# EAGLE design esptoy_v122 (EAGLE 7.2.0)
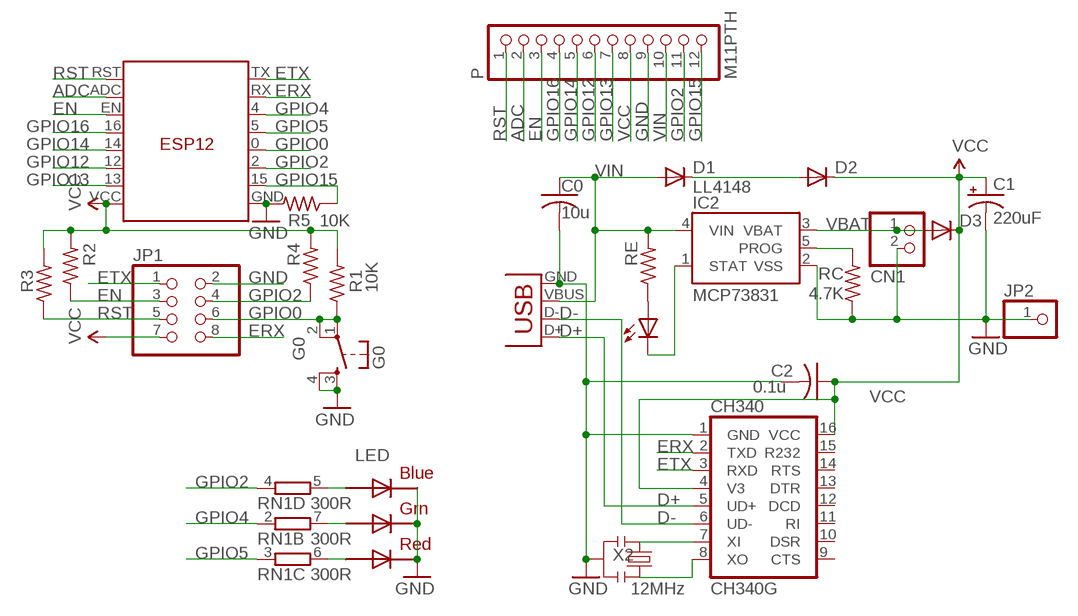
[diagram p0: schematic, sheet 1]

## Parts
C0  10u  C-USC0805K  [C0805K]
C1  220uF  CAP_POL7343  [EIA7343]
C2  0.1u  C-USC0603K  [C0603K]
CH340  CH340G  [SO16]
CHG  0805  LEDCHIPLED_0805  [CHIPLED_0805]
CN1  JST_2PIN-SMT-RA  [JST-PH-2-SMT-RA]
D1  LL4148  DIODESMA  [SMA-DIODE]
D2  DIODESMA  [SMA-DIODE]
D3  DIODESMA  [SMA-DIODE]
G0  G0  TAC_SWITCHSMD  [TACTILE_SWITCH_SMD]
IC2  MCP73831  [SOT23-5]
JP1  PINHD-2X4  [2X04]
JP2  PINHD-1X1CB  [1X01-CLEANBIG]
LED  RGBLED5050  [RGBLED5050]
P  M11PTH  PINHD-1X12-CB  [1X12-CB]
R1  10K  R-US_R0603  [R0603]
R2  R-US_R0603  [R0603]
R3  R-US_R0603  [R0603]
R4  R-US_R0603  [R0603]
R5  10K  R-US_R0603  [R0603]
RC  4.7K  R-US_R0805  [R0805]
RE  R-US_R0603  [R0603]
RN1  300R  4R-NEXB38V  [EXB38V]
U$1  ESP12  [ESP12]
X1  USBSMD  [USB-MINIB]
X2  12MHz  RESONATORSMD  [RESONATOR-SMD]

## Nets
ADC: P.2 U$1.ADC
D+: CH340.5(UD+) X1.D+
D-: CH340.6(UD-) X1.D-
EN: JP1.3 P.3 R2.1 U$1.EN
ERX: CH340.2(TXD) JP1.8 U$1.RX
ETX: CH340.3(RXD) JP1.1 U$1.TX
GND: C0.2 C1.C(-) C2.2 CH340.1(GND) CN1.2 G0.3 G0.4 IC2.2(VSS) JP1.2 JP2.1 LED.4(BLUE_C) LED.5(RED_C) LED.6(GREEN_C) P.9 R5.2 RC.1 U$1.GND X1.GND X2.2
GPIO0: G0.1 G0.2 JP1.6 R1.1 U$1.0(G0)
GPIO2: JP1.4 P.11 R4.1 RN1.4 U$1.2(G2)
GPIO4: RN1.2 U$1.4(G4)
GPIO5: RN1.3 U$1.5(G5)
GPIO12: P.6 U$1.12(G12)
GPIO13: P.7 U$1.13(G13)
GPIO14: P.5 U$1.14(G14)
GPIO15: P.12 R5.1 U$1.15(G15)
GPIO16: P.4 U$1.16(G16)
N$1: D1.C D2.A
N$2: LED.3(BLUE_A) RN1.5
N$3: IC2.5(PROG) RC.2
N$4: CHG.A RE.1
N$5: CHG.C IC2.1(STAT)
N$6: LED.1(GREEN_A) RN1.7
N$7: LED.2(RED_A) RN1.6
N$11: CH340.7(XI) X2.1
N$13: CH340.8(XO) X2.3
RST: JP1.5 P.1 R3.1 U$1.RST
VBAT [power]: CN1.1 D3.A IC2.3(VBAT)
VCC [power]: C1.A(+) C2.1 CH340.4(V3) CH340.16(VCC) D2.C D3.C JP1.7 P.8 R1.2 R2.2 R3.2 R4.2 U$1.VCC
VIN [power]: C0.1 D1.A IC2.4(VIN) P.10 RE.2 X1.VBUS
Unconnected: CH340.9(CTS) CH340.10(DSR) CH340.11(RI) CH340.12(DCD) CH340.13(DTR) CH340.14(RTS) CH340.15(R232) RN1.1 RN1.8

## Library data of the parts
C0 = adafruit2013:C-US: CAPACITOR, American symbol
C1 = SparkFunNew:CAP_POL: Capacitor Polarized These are standard SMD and PTH capacitors. Normally 10uF, 47uF, and 100uF in electrolytic and tantalum varieties. Always verify the external diameter of the through hole cap, it varies with capacity, voltage, and manufacturer. The EIA devices should be standard.
C2 = adafruit:C-US: CAPACITOR, American symbol
CH340 = SparkFunNew:CH340
CHG = led:LED: LED OSRAM: - CHIPLED LG R971, LG N971, LY N971, LG Q971, LY Q971, LO R971, LY R971 LH N974, LH R974 LS Q976, LO Q976, LY Q976 LO Q996 - Hyper CHIPLED LW Q18S LB Q993, LB Q99A, LB R99A - SideLED LS A670, LO A670, LY A670, LG A670, LP A670 LB A673, LV A673, LT A673, LW A673 LH A674 LY A675 LS A676, LA A676, LO A676, LY A676, LW A676 LS A679, LY A679, LG A679 - Hyper Micro SIDELED® LS Y876, LA Y876, LO Y876, LY Y876 LT Y87S - SmartLED LW L88C, LW L88S LB L89C, LB L89S, LG L890 LS L89K, LO L89K, LY L89K LS L896, LA L896, LO L896, LY L896 - TOPLED LS T670, LO T670, LY T670, LG T670, LP T670 LSG T670, LSP T670, LSY T670, LOP T670, LYG T670 LG T671, LOG T671, LSG T671 LB T673, LV T673, LT T673, LW T673 LH T674 LS T676, LA T676, LO T676, LY T676, LB T676, LH T676, LSB T676, LW T676 LB T67C, LV T67C, LT T67C, LS T67K, LO T67K, LY T67K, LW E67C LS E67B, LA E67B, LO E67B, LY E67B, LB E67C, LV E67C, LT E67C LW T67C LS T679, LY T679, LG T679 LS T770, LO T770, LY T770, LG T770, LP T770 LB T773, LV T773, LT T773, LW T773 LH T774 LS E675, LA E675, LY E675, LS T675 LS T776, LA T776, LO T776, LY T776, LB T776 LHGB T686 LT T68C, LB T68C - Hyper Mini TOPLED® LB M676 - Mini TOPLED Santana® LG M470 LS M47K, LO M47K, LY M47K Source: http://www.osram.convergy.de LUXEON: - LUMILED® LXK2-PW12-R00, LXK2-PW12-S00, LXK2-PW14-U00, LXK2-PW14-V00 LXK2-PM12-R00, LXK2-PM12-S00, LXK2-PM14-U00 LXK2-PE12-Q00, LXK2-PE12-R00, LXK2-PE12-S00, LXK2-PE14-T00, LXK2-PE14-U00 LXK2-PB12-K00, LXK2-PB12-L00, LXK2-PB12-M00, LXK2-PB14-N00, LXK2-PB14-P00, LXK2-PB14-Q00 LXK2-PR12-L00, LXK2-PR12-M00, LXK2-PR14-Q00, LXK2-PR14-R00 LXK2-PD12-Q00, LXK2-PD12-R00, LXK2-PD12-S00 LXK2-PH12-R00, LXK2-PH12-S00 LXK2-PL12-P00, LXK2-PL12-Q00, LXK2-PL12-R00 Source: www.luxeon.com KINGBRIGHT: KA-3528ASYC Source: www.kingbright.com
CN1 = adafruit:JST_2PIN: JST 2-Pin Connectors of various flavors SMT-RA (S2B-PH-SM4) 4UConnector #17311 SMT (B2B-PH-SM4) THM-RA (S2B-PH) THM (B2B-PH)
D1-D3 = SparkFunNew:DIODE: Diode These are standard reverse protection diodes and small signal diodes. SMA package can handle up to about 1A. SOD-323 can handle about 200mA. What the SOD-323 package when ordering, there are some mfgs out there that are 5-pin packages.
G0 = SparkFunNew:TAC_SWITCH: Momentary Switch Button commonly used for reset or general input. Spark Fun Electronics SKU : COM-00097
IC2 = SparkFunNew:MCP73831: Microchip's MCP73831 Miniature single cell, fully integrated Li-Ion, Li-polymer charge management controller http://ww1.microchip.com/downloads/en/DeviceDoc/21984a.pdf
JP1 = pinhead:PINHD-2X4: PIN HEADER
JP2 = adafruit:PINHD-1X1: Pin header 1x1 for 0.1" spacing With round pins
LED = adafruit:RGBLED: For 5050 RGB LEDs, the order of the LEDs may vary from one manufacturer to another!
P = adafruit:PINHD-1X12: PIN HEADER
R1-R5 RE = adafruit (picker 的冲突副本 2014-10-29):R-US_: RESISTOR, American symbol
RC = adafruit2013:R-US_: RESISTOR, American symbol
RN1 = resistor-dil:4R-N: Array Chip Resistor Source: RS Component / Phycomp; OC_FARNELL: unknown; OC_NEWARK: unknown
U$1 = JeeParts:ESP12
X1 = SparkFun:USB: USB Connectors USB-B-PTH is fully proven SKU : PRT-00139 USB-miniB is fully proven SKU : PRT-00587 USB-A-PCB is untested. USB-A-H is throughly reviewed, but untested. Spark Fun Electronics SKU : PRT-00437 USB-B-SMT is throughly reviewed, but untested. Needs silkscreen touching up. USB-A-S has not been used/tested USB-MB-H has not been used/tested
X2 = SparkFunNew:RESONATOR: Resonator Small SMD resonator. This is the itty bitty 10/20MHz resonators with built in caps. CSTCE10M0G55 and CSTCE20M0V53. Footprint has been reviewed closely but hasn't been tested yet.

## Net classes
0 default: width 0.178 mm, clearance 0.178 mm
1 power: width 0.254 mm, clearance 0.203 mm

## Board
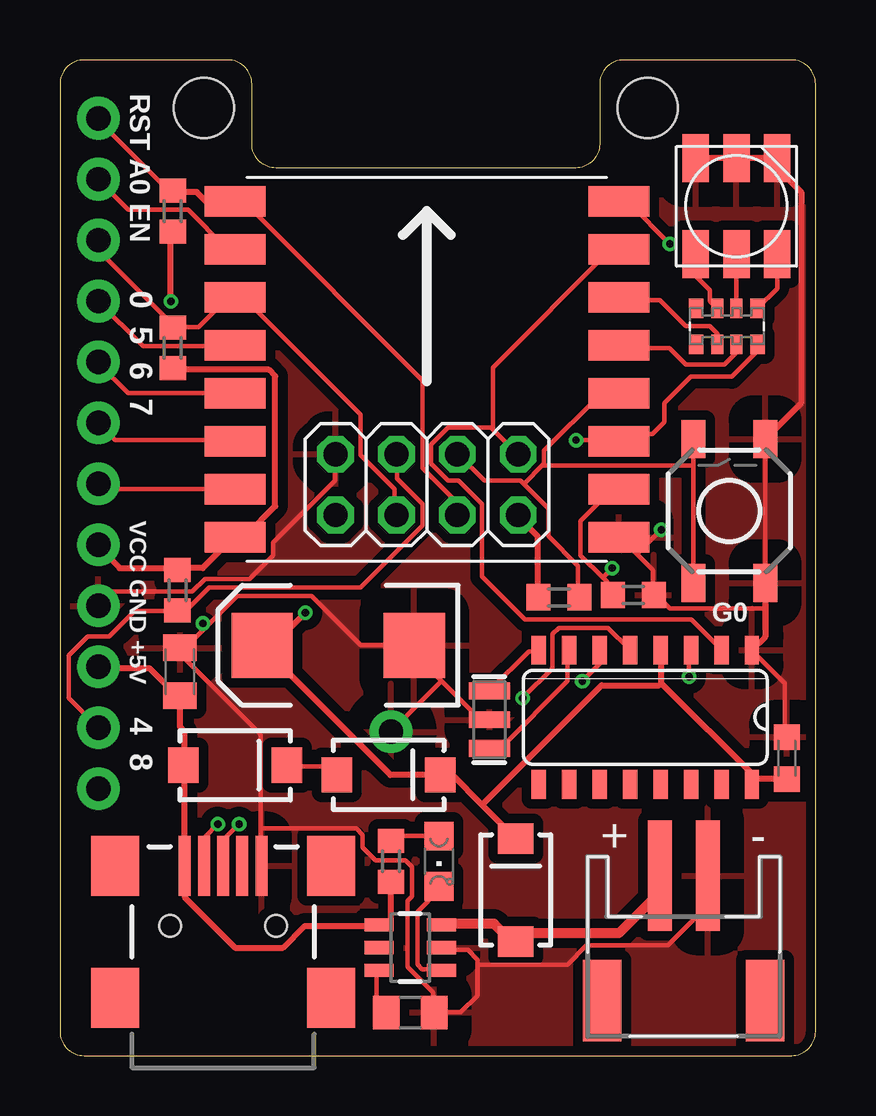
[diagram p1: board, top side]
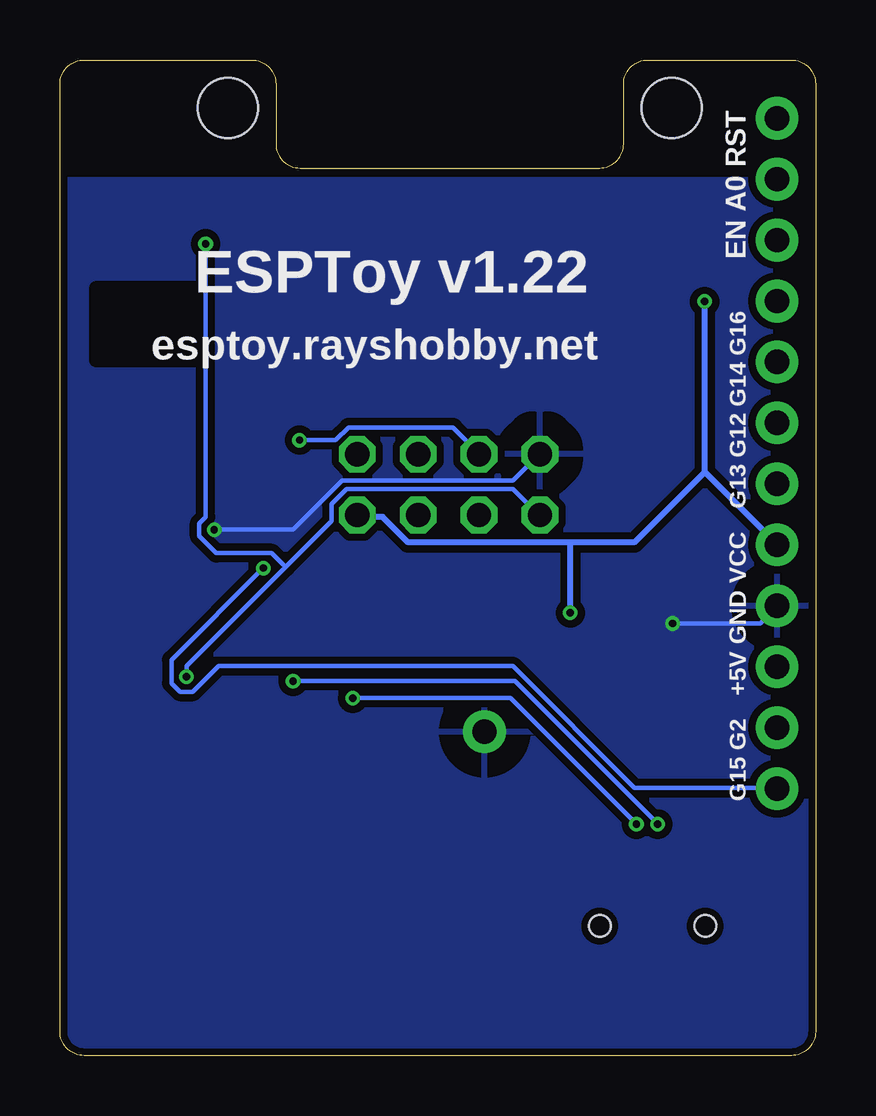
[diagram p2: board, bottom side, seen from below]

Size 31.5 x 41.5 mm. Coordinates in mm from the lower left corner, seen from the top.
Outline: 1,0 30.5,0 arc90 31.5,1 31.5,40.5 arc90 30.5,41.5 23.5,41.5 arc90 22.5,40.5 22.5,38 arc-90 21.5,37 9,37 arc-90 8,38 8,40.5 arc90 7,41.5 1,41.5 arc90 0,40.5 0,1 arc90 1,0
Copper layers (1*16): Top 0.035mm / dielectric 1.5mm / Bottom 0.035mm
Design rules "Fusion_eagle_rule_v1.1 *": minimum track width 6mil, minimum drill 12mil, track to track 6mil, track to pad 6mil, pad to pad 6mil, via to via 6mil, smd to smd 0mil, copper to edge 10mil, drill to drill 10mil, minimum pad ring 10mil, minimum via ring 6mil, stop-mask expansion 2mil, vias tented up to drill 100mil, thermal gap 40mil
Holes 2.5 mm at 24.5,39.5 6,39.5
tRestrict: area 22.7,37.7 to 26.3,41.3; area 4.2,37.7 to 7.8,41.3
bRestrict: area 25.5,29 to 30,32
vRestrict: area 2.9,10.4 to 3.9,40

### Footprints (pad centres in the part's own frame; a part is rotated, then mirrored left to right if it is on the bottom)
C0805K = smd 1.1 x 1.4: 1 -1,0; 2 1,0
EIA7343 = smd 2.55 x 2.7: A 3.17,0; C -3.17,0
C0603K = smd 1.05 x 1.08: 1 -0.875,0; 2 0.875,0
SO16 = smd 0.6 x 1.2: 1 -4.445,-2.8; 2 -3.175,-2.8; 3 -1.905,-2.8; 4 -0.635,-2.8; 5 0.635,-2.8; 6 1.905,-2.8; 7 3.175,-2.8; 8 4.445,-2.8; 9 4.445,2.8; 10 3.175,2.8; 11 1.905,2.8; 12 0.635,2.8; 13 -0.635,2.8; 14 -1.905,2.8; 15 -3.175,2.8; 16 -4.445,2.8
CHIPLED_0805 = smd 1.2 x 1.2: A 0,-1.05; C 0,1.05
JST-PH-2-SMT-RA = smd 1 x 4.6: 1 1,-3.7; 2 -1,-3.7 | smd 1.6 x 3.4: NC1 -3.4,1.5; NC2 3.4,1.5
SMA-DIODE = smd 1.27 x 1.47: A -2.15,0; C 2.15,0
TACTILE_SWITCH_SMD = smd 1.6 x 1: 1 -3,1.5; 2 3,1.5; 3 -3,-1.5; 4 3,-1.5
SOT23-5 = smd 0.55 x 1.2: 1 -0.95,-1.3; 2 0,-1.3; 3 0.95,-1.3; 4 0.95,1.3; 5 -0.95,1.3; 6 0,1.3
2X04 = drill 1.016 octagon: 1 -3.81,-1.27; 2 -3.81,1.27; 3 -1.27,-1.27; 4 -1.27,1.27; 5 1.27,-1.27; 6 1.27,1.27; 7 3.81,-1.27; 8 3.81,1.27
1X01-CLEANBIG = drill 1.016 pad 1.778: 1 0,0
RGBLED5050 = smd 2 x 1.1: 1 -2,1.7; 2 -2,0; 3 -2,-1.7; 4 2,-1.7; 5 2,0; 6 2,1.7
1X12-CB = drill 1.016 pad 1.778: 1 -13.97,0; 2 -11.43,0; 3 -8.89,0; 4 -6.35,0; 5 -3.81,0; 6 -1.27,0; 7 1.27,0; 8 3.81,0; 9 6.35,0; 10 8.89,0; 11 11.43,0; 12 13.97,0
R0603 = smd 1 x 1.1: 1 -0.85,0; 2 0.85,0
R0805 = smd 1.1 x 1.4: 1 -1,0; 2 1,0
EXB38V = smd 0.6 x 0.8: 1 -1.275,-0.75; 4 1.275,-0.75; 5 1.275,0.75; 8 -1.275,0.75 | smd 0.5 x 0.8: 2 -0.4,-0.75; 3 0.4,-0.75; 6 0.4,0.75; 7 -0.4,0.75
ESP12 = smd 2.54 x 1.27: 0 8,-2; 2 8,-4; 4 8,2; 5 8,0; 12 -8,-4; 13 -8,-6; 14 -8,-2; 15 8,-6; 16 -8,0; ADC -8,4; EN -8,2; GND 8,-8; RST -8,6; RX 8,4; TX 8,6; VCC -8,-8
USB-MINIB = smd 2.5 x 0.5: D+ 2.5,0; D- 2.5,0.8; GND 2.5,-1.6; ID 2.5,-0.8; VBUS 2.5,1.6 | smd 2.5 x 2: GND@1 -3,-4.5; GND@2 -3,4.5; GND@3 2.5,4.5; GND@4 2.5,-4.5 | hole 0.9: 0,2.2; 0,-2.2
RESONATOR-SMD = smd 0.7 x 1.7: 1 -1.2,0; 2 0,0; 3 1.2,0

### Placement (x,y rotation side)
C0  5,16 90 top
C1  11.6,17.1 180 top
C2  30.3,12.4 90 top
CH340  24.4,14.1 180 top
CHG  15.8,8.1 180 top
CN1  26,3.8 180 top
D1  7.3,12.1 0 top
D2  13.7,11.7 0 top
D3  19,6.9 90 top
G0  27.9,22.7 90 top
IC2  14.6,4.5 90 top
JP1  15.3,23.8 0 top
JP2  13.8,13.5 270 top
LED  28.2,35.4 90 top
P  1.6,25.1 270 top
R1  20.8,19.1 180 top
R2  4.7,29.5 270 top
R3  4.7,35.2 270 top
R4  4.9,19.4 90 top
R5  23.9,19.2 0 top
RC  14.6,1.8 180 top
RE  13.8,8.1 270 top
RN1  27.8,30.4 0 top
U$1  15.3,29.6 0 top
X1  6.8,5.4 90 top
X2  17.9,14 90 top

### Tracks (layer width: path | path; a pad name or v marks a point on that pad's centre or on a via)
ADC
  Top 0.178: U$1.ADC 7.29,33.65 6.93,33.65 5.33,35.25 2.85,35.25 1.6,36.5 P.2
D+  (via drill 0.3)
  Top 0.178: v19.29,14.9 20.54,16.14 20.54,17.56 20.8,17.83 22.85,17.83 23.74,16.94 CH340.5 | v7.47,9.65 6.84,9.03 6.84,7.96 X1.D+
  Bottom 0.178: v19.29,14.9 12.71,14.9 v7.47,9.65
D-  (via drill 0.3)
  Top 0.178: v21.78,15.61 22.49,16.32 22.49,16.85 CH340.6 | v6.58,9.65 6.04,9.12 6.04,7.96 X1.D-
  Bottom 0.178: v21.78,15.61 12.54,15.61 v6.58,9.65
EN
  Top 0.178: JP1.3 13.96,22.54 13.96,23.61 12.54,25.03 12.54,26.72 7.73,31.52 7.38,31.52 U$1.EN 7.29,31.52 6.93,31.52 5.78,30.36 4.71,30.36 R2.1 4.71,30.45 1.6,33.56 1.6,33.92 P.3
ERX
  Top 0.178: 18,26.14 19.02,25.12 JP1.8 | 18,26.14 17.96,26.19 16.18,26.19 15.47,25.48 15.47,24.68 16.18,23.96 16.62,23.96 17.6,22.99 17.6,19.96 19.38,18.19 26.31,18.19 27.56,16.94 CH340.2 | U$1.RX 23.29,33.56 22.94,33.56 18.05,28.68 18.05,26.19 18,26.14
ETX  (via drill 0.3)
  Top 0.178: v26.23,15.79 26.23,16.85 CH340.3 | v25.43,33.83 23.74,35.52 23.38,35.52 U$1.TX
  Bottom 0.178: v26.23,15.79 26.23,16.23 22.09,20.36 | 22.09,20.36 20.18,22.27 20.18,22.99 19.56,23.61 12.62,23.61 11.56,22.54 JP1.1 | v25.43,33.83 25.43,22.45 25.69,22.19 25.69,21.65 24.98,20.94 22.67,20.94 22.09,20.36
GND  (via drill 0.3)
  Top 0.178: G0.4 G0.3 | 17.4,3.78 17.4,2.5 16.7,1.8 RC.1 15.56,1.83 15.56,2.63 14.49,3.69 14.49,6.45 14.67,6.63 14.67,7.87 14.4,8.14 13.16,8.14 12.62,8.67 12.62,9.21 12.36,9.47 8.36,9.47 | 17.4,3.78 17.4,4 17,4.4 16,4.4 IC2.2 | 17.4,3.78 21.16,3.78 21.96,4.58 25.34,4.58 26.94,6.18 26.94,7.43 CN1.2 | 15.91,15.61 14.85,16.67 14.85,17.03 C1.C 14.76,17.12 12.54,17.12 10.49,19.16 7.38,19.16 6.09,17.87 | 15.91,15.61 17.51,14.01 17.87,14.01 X2.2 | 8.36,9.47 8.36,7.96 X1.GND | 8.36,9.47 8.36,13.38 5.07,16.67 5.07,16.94 C0.2 5.16,16.94 6.09,17.87 | C2.2 30.23,13.3 30.23,15.52 28.89,16.85 CH340.1 | 24.8,19.16 R5.2 | 24.05,20.9 23.38,21.56 U$1.GND | 24.05,20.9 24.71,20.23 24.71,19.25 R5.2 | 29.4,18.63 25.43,18.63 24.89,19.16 R5.2 | JP1.2 11.47,25.03 11.47,23.96 8.89,21.39 8.89,20.85 7.91,19.88 6.04,19.88 5.51,19.34 2.13,19.34 1.6,18.81 P.9 | v25.07,21.92 24.05,20.9 | v5.96,18.01 6.09,17.87 | 15.91,15.61 13.87,13.56 JP2.1
  Top 0.254: G0.3 29.4,18.63 29.4,17.45 CH340.1 | G0.4 30.9,27.2 30.9,36 29.9,37 LED.4 LED.5 LED.6
  Bottom 0.178: v25.07,21.92 21.78,21.92 19.74,23.96 12.62,23.96 11.56,25.03 JP1.2 | v5.96,18.01 2.31,18.01 1.6,18.72 P.9
  pour Top (isolate 0.406): 32,36.5 32,-0.5 0,-0.5 0,36.5
  pour Bottom (isolate 0.305): 32,36.5 32,-0.5 0,-0.5 0,36.5
GPIO0
  Top 0.178: G0.2 26.4,24.59 | 26.4,24.59 G0.1 | 19.34,23.83 19.2,23.96 17.69,23.96 16.62,25.03 JP1.6 | 19.34,23.83 20.36,22.81 20.36,21.65 21.6,20.41 21.6,19.16 R1.1 | 19.34,23.83 20.14,24.63 | 20.14,24.63 20.18,24.68 20.18,25.21 22.49,27.52 23.29,27.52 U$1.0 | 26.4,24.59 20.18,24.59 20.14,24.63
GPIO2  (via drill 0.3)
  Top 0.178: RN1.4 29.07,29.38 28,28.3 26.3,28.3 25.2,27.2 25.2,26.4 24.7,25.9 23.6,25.9 U$1.2 23.29,25.65 v21.51,25.65 | P.11 1.51,13.74 0.36,14.9 0.36,16.67 1.16,17.47 2.04,17.47 3.11,18.54 R4.1 4.98,18.63 5.33,18.63 6.22,19.52 12.54,19.52 15.11,22.1 15.11,22.99 14.05,24.05 14.05,25.03 JP1.4
  Bottom 0.178: v21.51,25.65 20,25.65 19.47,26.19 15.11,26.19 14.05,25.12 JP1.4
GPIO4
  Top 0.178: RN1.2 27.4,30.1 27.1,30.4 26.1,30.4 25,31.5 23.4,31.5 U$1.4
GPIO5
  Top 0.178: RN1.3 28.2,29.3 27.7,28.8 26.1,28.8 25.4,29.5 23.4,29.5 U$1.5
GPIO12
  Top 0.178: U$1.12 7.29,25.65 2.31,25.65 P.6
GPIO13
  Top 0.178: U$1.13 1.78,23.61 1.6,23.79 P.7
GPIO14
  Top 0.178: U$1.14 2.85,27.61 1.6,28.85 P.5
GPIO15  (via drill 0.3)
  Top 0.178: 22.62,19.92 21.69,20.85 21.69,22.27 22.94,23.52 23.29,23.52 U$1.15 | 22.62,19.92 23.02,19.52 23.02,19.25 R5.1 | 22.62,19.92 v23.02,20.32
  Bottom 0.178: v23.02,20.32 26.85,16.5 26.85,15.52 26.49,15.16 25.96,15.16 24.89,16.23 12.62,16.23 7.56,11.16 1.6,11.16 P.12
GPIO16
  Top 0.178: U$1.16 7.29,29.57 3.47,29.57 1.6,31.43 P.4
N$1
  Top 0.178: D1.C 9.51,12.05 11.2,12.05 11.47,11.79 D2.A
N$2
  Top 0.178: LED.3 29.9,31.98 RN1.5
N$3
  Top 0.178: RC.2 13.6,2 13.2,2.4 13.2,3.45 IC2.5
N$4
  Top 0.178: CHG.A 14,9.15 RE.1
N$5
  Top 0.178: CHG.C 15.8,6.9 14.9,6 14.9,3.8 15.1,3.6 15.85,3.6 IC2.1
N$6
  Top 0.178: LED.1 26.5,32.5 27.1,31.9 27.1,31.45 RN1.7
N$7
  Top 0.178: LED.2 RN1.6
N$11
  Top 0.178: CH340.7 21.16,16.85 21.16,15.61 18.4,12.85 17.96,12.85 X2.1
N$13
  Top 0.178: CH340.8 19.91,16.85 19.56,16.85 17.96,15.25 X2.3
RST
  Top 0.178: R3.1 4.62,36.14 4.45,36.14 1.6,38.99 P.1 | JP1.5 16.54,22.54 16.54,23.07 15.11,24.5 15.11,28.14 7.73,35.52 7.38,35.52 U$1.RST
  Top 0.254: U$1.RST 6.1,35.6 5.7,36 4.7,36 R3.1
VBAT
  Top 0.406: CN1.1 25,6.8 23.3,5.1 19.35,5.1 D3.A 18.85,4.75 18.1,5.5 15.95,5.5 IC2.3
VCC  (via drill 0.3)
  Top 0.254: C2.1 29.07,11.53 CH340.16 28.98,11.61 25.07,15.52 | R2.2 4.71,28.59 8.71,28.59 8.98,28.32 8.98,22.9 7.73,21.65 7.38,21.65 U$1.VCC 7.2,21.56 5.96,20.32 4.98,20.32 R4.2 4.8,20.32 2.49,20.32 1.6,21.21 P.8 | R1.2 19.91,19.16 19.91,21.65 19.11,22.45 JP1.7 | v4.62,31.43 4.62,34.28 R3.2 | 25.07,15.52 25.07,16.85 CH340.4 | 17.6,10.45 18.94,9.12 D3.C | 17.6,10.45 16.36,11.7 15.91,11.7 D2.C 15.73,11.7 13.78,11.7 8.45,17.03 C1.A 8.71,16.94 v10.22,18.45 | 17.6,10.45 22.58,15.43 24.98,15.43 25.07,15.52
  Bottom 0.254: 4.62,24.32 v4.62,31.43 | 4.62,24.32 P.8 | 10.22,21.39 7.56,21.39 4.62,24.32 | 10.22,21.39 16.98,21.39 18.05,22.45 19.02,22.45 JP1.7 | v10.22,18.45 10.22,21.39
VIN
  Top 0.254: P.10 1.6,16.14 3.73,16.14 4.89,14.98 C0.1 5,13.7 5.2,13.5 5.2,12.2 D1.A 5.2,12 X1.VBUS 5.2,6.6 7.3,4.5 9.3,4.5 10.2,5.4 13.2,5.4 IC2.4 13.4,5.4 13.7,5.4 13.8,5.5 RE.2

### Text on the board
tPlace: RST A0 EN | 0 5 6 7 | VCC GND +5V | 4 8
bPlace: EN A0 RST | G13 G12 G14 G16 | +5V GND VCC | G15 G2
bNames: ESPToy v1.22 | esptoy.rayshobby.net